# EAGLE design SmartCar Arduino V4 (EAGLE 9.6.2)
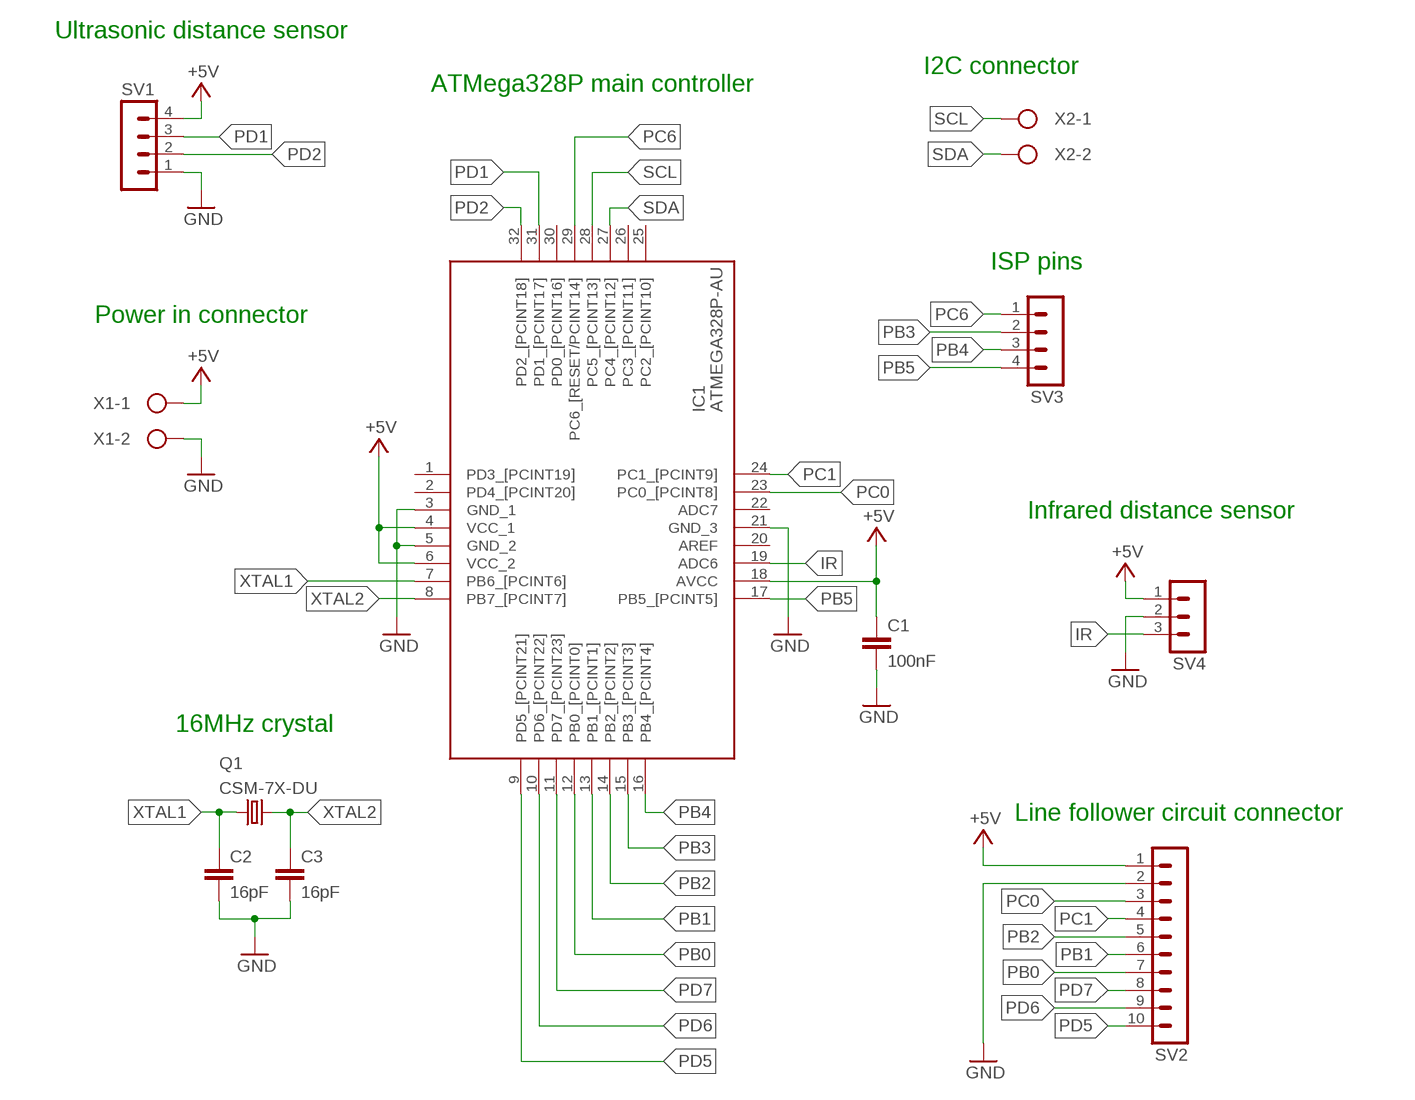
[diagram p0: schematic, sheet 1]

## Parts
C1  100nF  C-EUC0805  [C0805]
C2  16pF  C-EUC0805  [C0805]
C3  16pF  C-EUC0805  [C0805]
IC1  ATMEGA328P-AU  [QFP80P900X900X120-32N]
Q1  CSM-7X-DU  [CSM-7X-DU]
SV1  0  MA04-1  [MA04-1]
SV2  0  MA10-1  [MA10-1]
SV3  0  MA04-1  [MA04-1]
SV4  0  MA03-1  [MA03-1]
X1  0  W237-102  [W237-102]
X2  0  W237-102  [W237-102]

## Nets
+5V: C1.1 IC1.4(VCC_1) IC1.6(VCC_2) IC1.18(AVCC) SV1.4 SV2.1 SV4.1 X1.1
GND: C1.2 C2.2 C3.2 IC1.3(GND_1) IC1.5(GND_2) IC1.21(GND_3) SV1.1 SV2.2 SV4.2 X1.2
IR: IC1.19(ADC6) SV4.3
PB0: IC1.12(PB0_[PCINT0]) SV2.7
PB1: IC1.13(PB1_[PCINT1]) SV2.6
PB2: IC1.14(PB2_[PCINT2]) SV2.5
PB3: IC1.15(PB3_[PCINT3]) SV3.2
PB4: IC1.16(PB4_[PCINT4]) SV3.3
PB5: IC1.17(PB5_[PCINT5]) SV3.4
PC0: IC1.23(PC0_[PCINT8]) SV2.3
PC1: IC1.24(PC1_[PCINT9]) SV2.4
PC6: IC1.29(PC6_[RESET/PCINT14]) SV3.1
PD1: IC1.31(PD1_[PCINT17]) SV1.3
PD2: IC1.32(PD2_[PCINT18]) SV1.2
PD5: IC1.9(PD5_[PCINT21]) SV2.10
PD6: IC1.10(PD6_[PCINT22]) SV2.9
PD7: IC1.11(PD7_[PCINT23]) SV2.8
SCL: IC1.28(PC5_[PCINT13]) X2.1
SDA: IC1.27(PC4_[PCINT12]) X2.2
XTAL1: C2.1 IC1.7(PB6_[PCINT6]) Q1.1
XTAL2: C3.1 IC1.8(PB7_[PCINT7]) Q1.2
Unconnected: IC1.1(PD3_[PCINT19]) IC1.2(PD4_[PCINT20]) IC1.20(AREF) IC1.22(ADC7) IC1.25(PC2_[PCINT10]) IC1.26(PC3_[PCINT11]) IC1.30(PD0_[PCINT16])

## Notes on the sheet
- Ultrasonic distance sensor
- I2C connector
- ATMega328P main controller
- ISP pins
- Power in connector
- Infrared distance sensor
- 16MHz crystal
- Line follower circuit connector

## Library data of the parts
C1-C3 = rcl:C-EU: CAPACITOR, European symbol; SPICEPREFIX: C
IC1 = ATMEGA328P-AU:ATMEGA328P-AU: MICROCHIP - ATMEGA328P-AU. - MICROCONTROLLER MCU, 8 BIT, ATMEGA, 20MHZ, TQFP-32 Source: Datasheet <https://componentsearchengine.com/Datasheets/2/ATMEGA328P-AU.pdf>; ARROW_PART_NUMBER: ATMEGA328P-AU; ARROW_PRICE-STOCK: https://www.arrow.com/en/products/atmega328p-au/microchip-technology?region=nac; DESCRIPTION: MICROCHIP - ATMEGA328P-AU. - MICROCONTROLLER MCU, 8 BIT, ATMEGA, 20MHZ, TQFP-32; HEIGHT: 1.2mm; MANUFACTURER_NAME: Microchip; MANUFACTURER_PART_NUMBER: ATMEGA328P-AU; MOUSER_PART_NUMBER: 556-ATMEGA328P-AU; MOUSER_PRICE-STOCK: https://www.mouser.co.uk/ProductDetail/Microchip-Technology-Atmel/ATMEGA328P-AU?qs=K8BHR703ZXiCmmgp6%2FGNmQ%3D%3D
Q1 = crystal:CSM-7X-DU: SMD CRYSTAL Source: www.ecsxtal.com .. Crystal 3.6864MHz CSM_7X_DU.PDF; OC_FARNELL: unknown; OC_NEWARK: unknown
SV1 SV3 = con-lstb:MA04-1: PIN HEADER; OC_FARNELL: unknown; OC_NEWARK: unknown
SV2 = con-lstb:MA10-1: PIN HEADER; OC_FARNELL: unknown; OC_NEWARK: unknown
SV4 = con-lstb:MA03-1: PIN HEADER; OC_FARNELL: unknown; OC_NEWARK: unknown
X1 X2 = con-wago-500:W237-102: WAGO SCREW CLAMP; MPN: 237-102; OC_FARNELL: unknown; OC_NEWARK: 70K9898

## Board
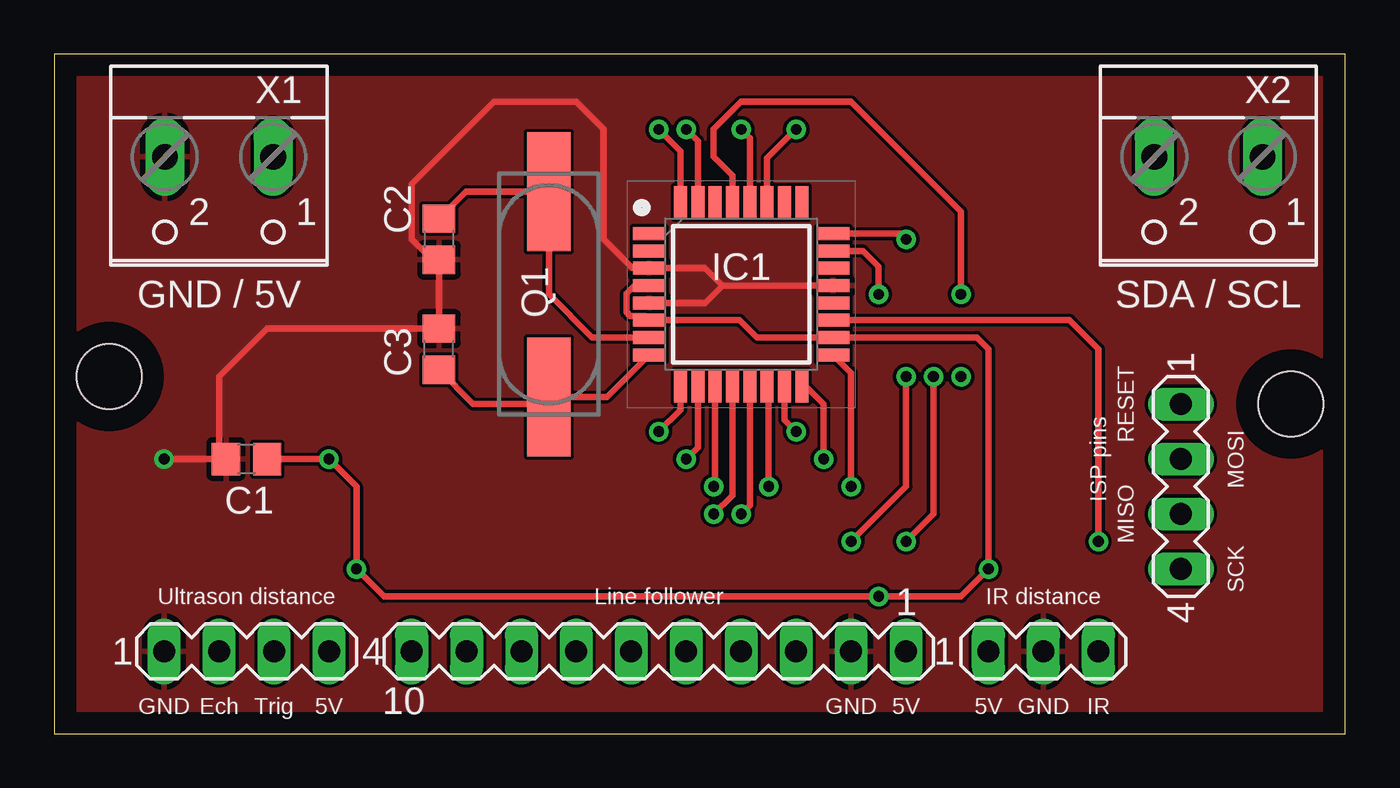
[diagram p1: board, top side]
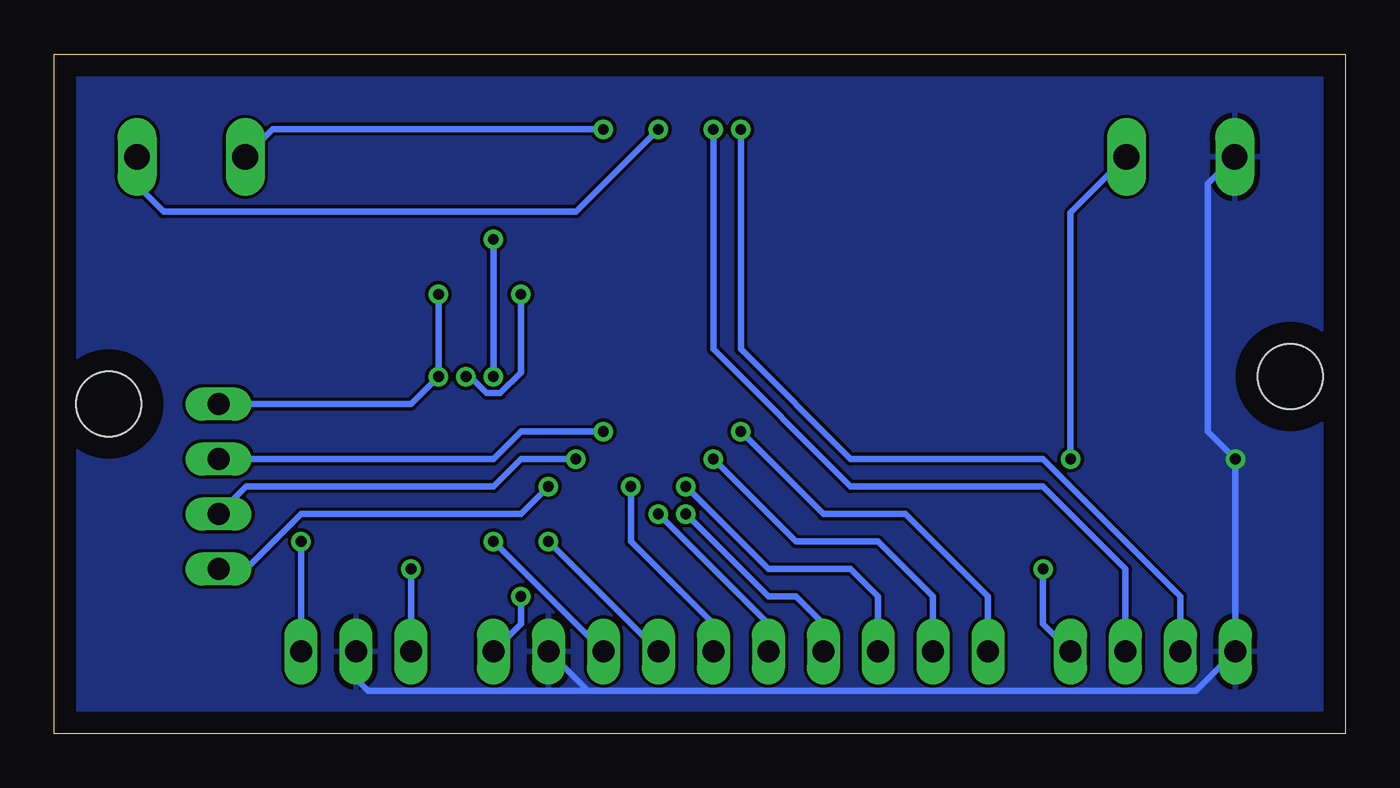
[diagram p2: board, bottom side, seen from below]

Size 59.67 x 31.42 mm. Coordinates in mm from the lower left corner, seen from the top.
Outline: 0,0 59.67,0 59.67,31.42 0,31.42 0,0
Copper layers (1*16): Top 0.035mm / dielectric 0.15mm / Bottom 0.035mm
Design rules "default": minimum track width 6mil, minimum drill 0.35mm, track to track 6mil, track to pad 6mil, pad to pad 6mil, via to via 6mil, smd to smd 6mil, copper to edge 40mil, drill to drill 6mil, minimum pad ring 10mil, minimum via ring 8mil, stop-mask expansion 4mil, vias tented up to drill 0mil, thermal gap 10mil
Holes 3 mm at 57.15,15.24 2.54,16.51

### Footprints (pad centres in the part's own frame; a part is rotated, then mirrored left to right if it is on the bottom)
C0805 = smd 1.3 x 1.5: 1 -0.95,0; 2 0.95,0
QFP80P900X900X120-32N = smd 1.5 x 0.6: 1 -4.25,2.8; 2 -4.25,2; 3 -4.25,1.2; 4 -4.25,0.4; 5 -4.25,-0.4; 6 -4.25,-1.2; 7 -4.25,-2; 8 -4.25,-2.8; 17 4.25,-2.8; 18 4.25,-2; 19 4.25,-1.2; 20 4.25,-0.4; 21 4.25,0.4; 22 4.25,1.2; 23 4.25,2; 24 4.25,2.8 | smd 0.6 x 1.5: 9 -2.8,-4.25; 10 -2,-4.25; 11 -1.2,-4.25; 12 -0.4,-4.25; 13 0.4,-4.25; 14 1.2,-4.25; 15 2,-4.25; 16 2.8,-4.25; 25 2.8,4.25; 26 2,4.25; 27 1.2,4.25; 28 0.4,4.25; 29 -0.4,4.25; 30 -1.2,4.25; 31 -2,4.25; 32 -2.8,4.25
CSM-7X-DU = smd 5.5 x 2: 1 -4.75,0; 2 4.75,0
MA04-1 = drill 1.016 long: 1 -3.81,0; 2 -1.27,0; 3 1.27,0; 4 3.81,0
MA10-1 = drill 1.016 long: 1 -11.43,0; 2 -8.89,0; 3 -6.35,0; 4 -3.81,0; 5 -1.27,0; 6 1.27,0; 7 3.81,0; 8 6.35,0; 9 8.89,0; 10 11.43,0
MA03-1 = drill 1.016 long: 1 -2.54,0; 2 0,0; 3 2.54,0
W237-102 = drill 1.194 long: 1 -2.5,-1.27; 2 2.5,-1.27

### Placement (x,y rotation side)
C1  8.89,12.7 180 top
C2  17.78,22.86 270 top
C3  17.78,17.78 90 top
IC1  31.75,20.32 0 top
Q1  22.86,20.32 270 top
SV1  8.89,3.81 0 top
SV2  27.94,3.81 180 top
SV3  52.07,11.43 270 top
SV4  45.72,3.81 0 top
X1  7.62,25.4 180 top
X2  53.34,25.4 180 top

### Tracks (layer width: path | path; a pad name or v marks a point on that pad's centre or on a via)
+5V  (via drill 0.5)
  Top 0.305: C1.1 v12.7,12.7 13.97,11.43 v13.97,7.62 15.24,6.35 v38.1,6.35 41.91,6.35 v43.18,7.62 43.18,17.78 42.64,18.32 IC1.18 32.48,18.32 31.68,19.12 IC1.6 27.3,19.32 26.62,19.32 26.45,19.49 26.45,20.35 26.82,20.72 IC1.4
  Bottom 0.305: 10.16,26.63 X1.1 12.7,24.09 v12.7,12.7 | SV2.1 38.1,5.08 v38.1,6.35 | v43.18,7.62 SV4.1 | v13.97,7.62 13.97,5.08 SV1.4
GND  (via drill 0.5)
  Top 0.305: C2.2 17.78,21.59 | 17.78,21.59 C3.2 9.84,18.73 7.62,16.51 7.62,13.02 C1.2 v5.08,12.7 | IC1.21 30.88,20.72 | IC1.5 30.08,19.92 30.88,20.72 | 30.88,20.72 30.08,21.52 IC1.3 26.74,21.52 25.4,22.86 25.4,27.94 24.13,29.21 20.32,29.21 16.51,25.4 16.51,22.86 17.78,21.59
  Bottom 0.305: SV2.2 35,1.98 | 35,1.98 6.91,1.98 SV1.1 v5.08,12.7 6.35,13.97 6.35,25.44 X1.2 | SV4.2 45.72,2.54 45.16,1.98 35,1.98
  pour Top: 0,31.75 0,0 59.69,0 59.69,31.75
  pour Bottom: 0,31.75 0,0 59.69,0 59.69,31.75
IR  (via drill 0.5)
  Top 0.305: v48.26,8.89 48.26,17.78 46.92,19.12 IC1.19
  Bottom 0.305: v48.26,8.89 SV4.3
PB0  (via drill 0.5)
  Top 0.305: v30.48,10.16 31.35,11.03 IC1.12
  Bottom 0.305: v30.48,10.16 26.67,6.35 25.4,6.35 24.13,5.08 SV2.7
PB1  (via drill 0.5)
  Top 0.305: IC1.13 32.15,10.56 v31.75,10.16
  Bottom 0.305: v31.75,10.16 26.67,5.08 SV2.6
PB2  (via drill 0.5)
  Top 0.305: IC1.14 33.02,16 v33.02,11.43
  Bottom 0.305: v33.02,11.43 33.02,8.89 29.21,5.08 SV2.5
PB3  (via drill 0.5)
  Top 0.305: IC1.15 33.75,14.51 v34.29,13.97
  Bottom 0.305: v34.29,13.97 38.1,13.97 39.37,12.7 SV3.2
PB4  (via drill 0.5)
  Top 0.305: IC1.16 34.73,16.07 35.56,15.24 v35.56,12.7
  Bottom 0.305: v35.56,12.7 38.1,12.7 39.37,11.43 50.8,11.43 SV3.3
PB5  (via drill 0.5)
  Top 0.305: IC1.17 36.83,16.69 v36.83,11.43
  Bottom 0.305: v36.83,11.43 38.1,10.16 48.26,10.16 50.8,7.62 SV3.4
PC0  (via drill 0.5)
  Top 0.305: v39.37,8.89 40.64,10.16 v40.64,16.51 | v38.1,20.32 38.1,21.59 37.37,22.32 IC1.23
  Bottom 0.305: SV2.3 v39.37,8.89 | v38.1,20.32 38.1,16.71 39.06,15.75 39.68,15.75 40.44,16.51 v40.64,16.51
PC1  (via drill 0.5)
  Top 0.305: v36.83,8.89 39.37,11.43 v39.37,16.51 | IC1.24 39.11,23.12 v39.37,22.86
  Bottom 0.305: SV2.4 v36.83,8.89 | v39.37,16.51 v39.37,22.86
PC6  (via drill 0.5)
  Top 0.305: IC1.29 31.35,25.8 30.48,26.67 30.48,27.94 31.75,29.21 36.83,29.21 41.91,24.13 v41.91,20.32
  Bottom 0.305: v41.91,20.32 v41.91,16.51 43.18,15.24 SV3.1
PD1  (via drill 0.5)
  Top 0.305: v29.21,27.94 29.75,27.4 IC1.31
  Bottom 0.305: SV1.3 10.16,7.62 13.97,11.43 22.86,11.43 29.21,17.78 v29.21,27.94
PD2  (via drill 0.5)
  Top 0.305: v27.94,27.94 28.95,26.93 IC1.32
  Bottom 0.305: SV1.2 7.62,6.35 13.97,12.7 22.86,12.7 27.94,17.78 v27.94,27.94
PD5  (via drill 0.5)
  Top 0.305: IC1.9 28.95,14.98 v27.94,13.97
  Bottom 0.305: v27.94,13.97 24.13,10.16 20.32,10.16 16.51,6.35 SV2.10
PD6  (via drill 0.5)
  Top 0.305: IC1.10 29.75,13.24 v29.21,12.7
  Bottom 0.305: v29.21,12.7 25.4,8.89 21.59,8.89 19.05,6.35 SV2.9
PD7  (via drill 0.5)
  Top 0.305: IC1.11 30.55,11.5 v30.48,11.43
  Bottom 0.305: v30.48,11.43 26.67,7.62 22.86,7.62 21.59,6.35 SV2.8
SCL  (via drill 0.5)
  Top 0.305: v31.75,27.94 32.15,27.54 IC1.28
  Bottom 0.305: X2.1 55.84,25.36 54.61,24.13 35.56,24.13 v31.75,27.94
SDA  (via drill 0.5)
  Top 0.305: IC1.27 32.95,26.6 v34.29,27.94
  Bottom 0.305: v34.29,27.94 49.57,27.94 X2.2
XTAL1
  Top 0.305: C2.1 19.04,25.07 Q1.1 22.86,20.32 24.86,18.32 IC1.7
XTAL2
  Top 0.305: C3.1 19.37,15.24 22.86,15.24 Q1.2 25.55,15.57 IC1.8

### Text on the board
tNames: GND / 5V | SDA / SCL | RESET | ISP pins | MOSI | MISO | SCK | Ultrason distance | Line follower | IR distance | GND | Ech | Trig | 5V | GND | 5V | 5V | GND | IR